# EAGLE schematic Led_display (EAGLE 9.3.0)
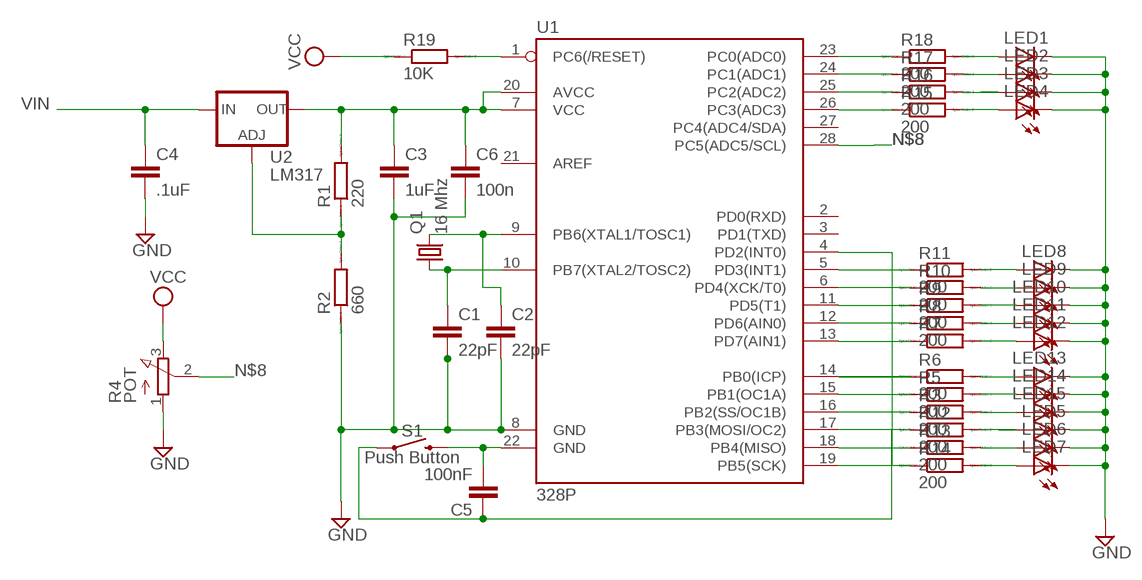
[diagram p0: schematic, sheet 1]

## Parts
C1  22pF  C2,5-3  [C2.5-3]
C2  22pF  C2,5-3  [C2.5-3]
C3  1uF  C2,5-3  [C2.5-3]
C4  .1uF  C2,5-3  [C2.5-3]
C5  100nF  C2,5-3  [C2.5-3]
C6  100n  C2,5-3  [C2.5-3]
LED1  LED  [SMARTLED-TTW]
LED2  LED  [SMARTLED-TTW]
LED3  LED  [SMARTLED-TTW]
LED4  LED  [SMARTLED-TTW]
LED5  LED  [SMARTLED-TTW]
LED6  LED  [SMARTLED-TTW]
LED7  LED  [SMARTLED-TTW]
LED8  LED  [SMARTLED-TTW]
LED9  LED  [SMARTLED-TTW]
LED10  LED  [SMARTLED-TTW]
LED11  LED  [SMARTLED-TTW]
LED12  LED  [SMARTLED-TTW]
LED13  LED  [SMARTLED-TTW]
LED14  LED  [SMARTLED-TTW]
LED15  LED  [SMARTLED-TTW]
Q1  16 Mhz  CRYSTALHC18U-V  [HC18U-V]
R1  220  RR2010  [R2010]
R2  660  RR2010  [R2010]
R3  200  R  [R0805]
R4  POT  3RP/1610N  [3RP/1610N]
R5  200  R  [R0805]
R6  200  R  [R0805]
R7  R  [R0805]
R8  200  R  [R0805]
R9  200  R  [R0805]
R10  200  R  [R0805]
R11  200  R  [R0805]
R12  200  R  [R0805]
R13  200  R  [R0805]
R14  200  R  [R0805]
R15  200  R  [R0805]
R16  200  R  [R0805]
R17  200  R  [R0805]
R18  200  R  [R0805]
R19  10K  RR0402  [R0402]
S1  Push Button  MOMENTARY-SWITCH-SPST-PTH-6.0MM  [TACTILE_SWITCH_PTH_6.0MM]
U1  328P  ATMEGA328P_PDIP  [DIP28]
U2  LM317  V_REG_317DPACK  [V-REG_DPACK]

## Nets
GND: C1.2 C2.2 C3.2 C4.2 C6.2 LED1.C@1(C) LED2.C@1(C) LED3.C@1(C) LED4.C@1(C) LED5.C@1(C) LED6.C@1(C) LED7.C@1(C) LED8.C@1(C) LED9.C@1(C) LED10.C@1(C) LED11.C@1(C) LED12.C@1(C) LED13.C@1(C) LED14.C@1(C) LED15.C@1(C) R2.1 R4.1(A) U1.8(GND)
N$1: C2.1 Q1.2 U1.9(PB6(XTAL1/TOSC1))
N$2: C1.1 Q1.1 U1.10(PB7(XTAL2/TOSC2))
N$3: C3.1 C6.1 R1.2 U1.7(VCC) U1.20(AVCC) U2.4(OUT)
N$4: R1.1 R2.2 U2.1(ADJ)
N$5: C5.2 S1.3 U1.22(GND)
N$8: R4.2(S) U1.28(PC5(ADC5/SCL))
N$9: U1.4(PD2(INT0))
N$10: R18.1 U1.23(PC0(ADC0))
N$11: R17.1 U1.24(PC1(ADC1))
N$12: R16.1 U1.25(PC2(ADC2))
N$13: R15.1 U1.26(PC3(ADC3))
N$14: R12.1 U1.17(PB3(MOSI/OC2))
N$15: R13.1 U1.18(PB4(MISO))
N$16: R14.1 U1.19(PB5(SCK))
N$17: R11.1 U1.5(PD3(INT1))
N$18: R10.1 U1.6(PD4(XCK/T0))
N$19: R9.1 U1.11(PD5(T1))
N$20: R8.1 U1.12(PD6(AIN0))
N$21: R7.1 U1.13(PD7(AIN1))
N$22: R6.1 U1.14(PB0(ICP))
N$23: R5.1 U1.15(PB1(OC1A))
N$24: R3.1 U1.16(PB2(SS/OC1B))
N$25: LED1.A@1(A) R18.2
N$26: LED2.A@1(A) R17.2
N$27: LED3.A@1(A) R16.2
N$28: LED4.A@1(A) R15.2
N$29: LED5.A@1(A) R12.2
N$30: LED6.A@1(A) R13.2
N$31: LED7.A@1(A) R14.2
N$32: LED8.A@1(A) R11.2
N$33: LED9.A@1(A) R10.2
N$34: LED10.A@1(A) R9.2
N$35: LED11.A@1(A) R8.2
N$36: LED12.A@1(A) R7.2
N$37: LED13.A@1(A) R6.2
N$38: LED14.A@1(A) R5.2
N$39: LED15.A@1(A) R3.2
N$40: R19.2 U1.1(PC6(/RESET))
N$41: C5.1 S1.1
VCC: R4.3(E) R19.1
VIN: C4.1 U2.3(IN)
Unconnected: U1.2(PD0(RXD)) U1.3(PD1(TXD)) U1.21(AREF) U1.27(PC4(ADC4/SDA))

## Library data of the parts
C1-C6 = capacitor-wima:C: CAPACITOR naming: grid - package width
LED1-LED15 = led:LED: LED OSRAM: - CHIPLED LG R971, LG N971, LY N971, LG Q971, LY Q971, LO R971, LY R971 LH N974, LH R974 LS Q976, LO Q976, LY Q976 LO Q996 - Hyper CHIPLED LW Q18S LB Q993, LB Q99A, LB R99A - SideLED LS A670, LO A670, LY A670, LG A670, LP A670 LB A673, LV A673, LT A673, LW A673 LH A674 LY A675 LS A676, LA A676, LO A676, LY A676, LW A676 LS A679, LY A679, LG A679 - Hyper Micro SIDELED® LS Y876, LA Y876, LO Y876, LY Y876 LT Y87S - SmartLED LW L88C, LW L88S LB L89C, LB L89S, LG L890 LS L89K, LO L89K, LY L89K LS L896, LA L896, LO L896, LY L896 - TOPLED LS T670, LO T670, LY T670, LG T670, LP T670 LSG T670, LSP T670, LSY T670, LOP T670, LYG T670 LG T671, LOG T671, LSG T671 LB T673, LV T673, LT T673, LW T673 LH T674 LS T676, LA T676, LO T676, LY T676, LB T676, LH T676, LSB T676, LW T676 LB T67C, LV T67C, LT T67C, LS T67K, LO T67K, LY T67K, LW E67C LS E67B, LA E67B, LO E67B, LY E67B, LB E67C, LV E67C, LT E67C LW T67C LS T679, LY T679, LG T679 LS T770, LO T770, LY T770, LG T770, LP T770 LB T773, LV T773, LT T773, LW T773 LH T774 LS E675, LA E675, LY E675, LS T675 LS T776, LA T776, LO T776, LY T776, LB T776 LHGB T686 LT T68C, LB T68C - Hyper Mini TOPLED® LB M676 - Mini TOPLED Santana® LG M470 LS M47K, LO M47K, LY M47K Source: http://www.osram.convergy.de LUXEON: - LUMILED® LXK2-PW12-R00, LXK2-PW12-S00, LXK2-PW14-U00, LXK2-PW14-V00 LXK2-PM12-R00, LXK2-PM12-S00, LXK2-PM14-U00 LXK2-PE12-Q00, LXK2-PE12-R00, LXK2-PE12-S00, LXK2-PE14-T00, LXK2-PE14-U00 LXK2-PB12-K00, LXK2-PB12-L00, LXK2-PB12-M00, LXK2-PB14-N00, LXK2-PB14-P00, LXK2-PB14-Q00 LXK2-PR12-L00, LXK2-PR12-M00, LXK2-PR14-Q00, LXK2-PR14-R00 LXK2-PD12-Q00, LXK2-PD12-R00, LXK2-PD12-S00 LXK2-PH12-R00, LXK2-PH12-S00 LXK2-PL12-P00, LXK2-PL12-Q00, LXK2-PL12-R00 Source: www.luxeon.com KINGBRIGHT: KA-3528ASYC Source: www.kingbright.com
Q1 = crystal:CRYSTAL: CRYSTAL; OC_FARNELL: unknown; OC_NEWARK: unknown
R1-R3 R5-R19 = eagle-ltspice:R: RESISTOR, European symbol; SPICEMODEL: NONE; SPICEPREFIX: R
R4 = pot:3RP/1610N: 16mm Potentiometer one level Source: http://www.alphapotentiometers.net/html/16mm_pot_2.html
S1 = SparkFun-Switches:MOMENTARY-SWITCH-SPST: Momentary Switch (Pushbutton) - SPST Normally-open (NO) SPST momentary switches (buttons, pushbuttons). Variants PTH-12MM - 12mm square, through-hole Momentary Pushbutton Switch - 12mm Square <https://www.sparkfun.com/products/9190> (COM-09190) PTH-6.0MM, PTH-6.0MM-KIT - 6.0mm square, through-hole Mini Pushbutton Switch <https://www.sparkfun.com/products/97> (COM-00097) KIT package intended for soldering kit's - only one side of pads' copper is exposed. PTH-RIGHT-ANGLE-KIT - Right-angle, through-hole Right Angle Tactile Button <https://www.sparkfun.com/products/10791> - Used on SparkFun BigTime Watch Kit <https://www.sparkfun.com/products/11734> SMD-12MM - 12mm square, surface-mount Tactile Button - SMD (12mm) <https://www.sparkfun.com/products/12993> (COM-12993) Used on SparkFun PicoBoard <https://www.sparkfun.com/products/11888> SMD-4.5MM - 4.5mm Square Trackball Switch Used on SparkFun Blackberry Trackballer Breakout <https://www.sparkfun.com/products/13169> SMD-4.6MMX2.8MM - 4.60mm x 2.80mm, surface mount Used on SparkFun SAMD21 Mini Breakout <https://www.sparkfun.com/products/13664> SMD-5.2MM, SMD-5.2-REDUNDANT - 5.2mm square, surface-mount Mini Pushbutton Switch - SMD <https://www.sparkfun.com/products/8720> (COM-08720) Used on Arduino Pro Mini <https://www.sparkfun.com/products/11114> REDUNDANT package connects both switch circuits together SMD-6.0X3.5MM - 6.0 x 3.5mm, surface mount Momentary Reset Switch SMD <https://www.sparkfun.com/products/8229> (COM-08229) SMD-6.2MM-TALL - 6.2mm square, surface mount Tactile Button - SMD (6mm) <https://www.sparkfun.com/products/12992> Used on SparkFun Digital Sandbox <https://www.sparkfun.com/products/12651> SMD-RIGHT-ANGLE - Right-angle, surface mount Used on SparkFun Block for Intel® Edison - Arduino <https://www.sparkfun.com/products/13036>; PROD_ID: SWCH-08441; SF_SKU: COM-00097
U1 = SparkFun-IC-Microcontroller:ATMEGA328P_PDIP: Atmel 328P Through hole ATMEGA328P uC used in the Arduino 32kb flash, 1k EEPROM, 2k SRAM Datasheet <http://www.sparkfun.com/datasheets/Components/SMD/ATMega328.pdf> SparkFun Products Storefront component: AVR 28 Pin 20MHz 32K 6A/D - ATMega328P <https://www.sparkfun.com/products/9061> (COM-09061) SparkFun Simon Says - Through-Hole Soldering Kit <https://www.sparkfun.com/products/10547> (KIT-10547) SparkFun Learn to Solder - Simon Says <https://www.sparkfun.com/products/13708> (KIT-13708) SparkFun BigTime Watch Kit <https://www.sparkfun.com/products/11734> (KIT-11734) SparkFun ClockIt <https://www.sparkfun.com/products/10930> (KIT-10930) SparkFun Serial Enabled LCD Kit <https://www.sparkfun.com/products/10097> (LCD-10097) SparkFun Simon Tilts - Through Hole Soldering Kit <https://www.sparkfun.com/products/12634> (KIT-12634) SparkFun Frequency Counter Kit <https://www.sparkfun.com/products/10140> (KIT-10140) FabFM Radio Kit <https://www.sparkfun.com/products/11043> (KIT-11043) SparkFun Binary Blaster Kit <https://www.sparkfun.com/products/12037> (KIT-12037) SparkFun Metro-Gnome <https://www.sparkfun.com/products/9236> (KIT-09236) ATmega328 with Arduino Optiboot (Uno) <https://www.sparkfun.com/products/10524> (DEV-10524); PROD_ID: IC-09136
U2 = SparkFun-IC-Power:V_REG_317: Voltage Regulator Standard LM317 adjustable voltage regulator. AOI (Adjust Output Input). Google 'LM317 Calculator' for easy to use app to get the two resistor values needed. 240/720 for 5V output. 240/390 for 3.3V output. Spark Fun Electronics SKU : COM-00527; PROD_ID: IC-09888